# Altium schematic sheet Main.SchDoc
size 203 x 116 mm
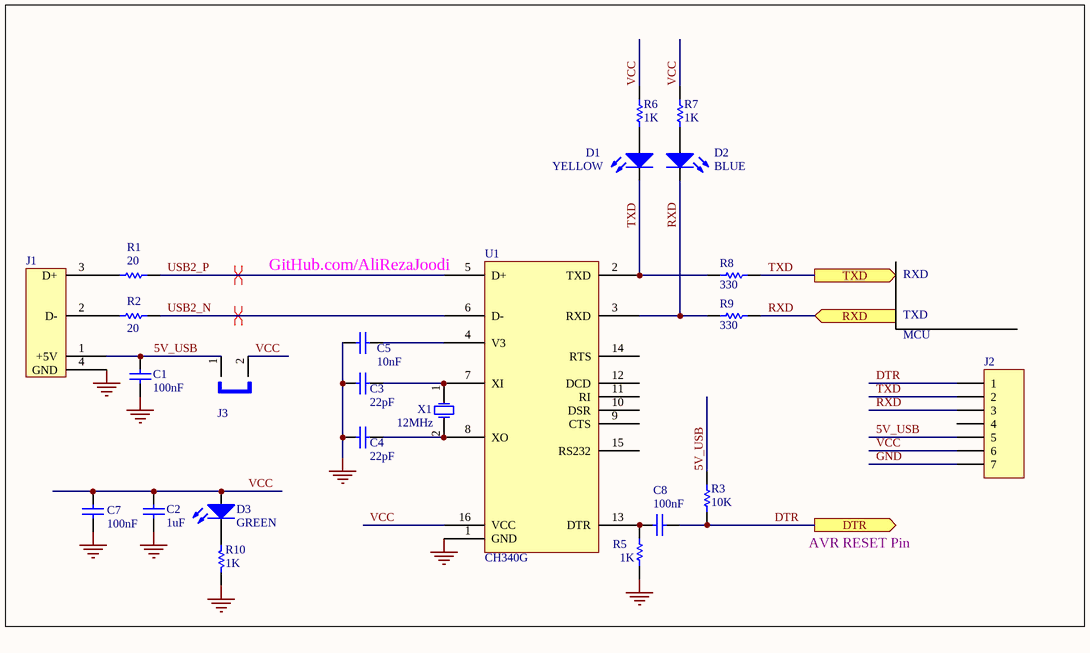
[diagram p0: Main.SchDoc]

## Parts
C1  100nF  [0805]
C2  1uF  [0805]
C3  22pF  [0805]
C4  22pF  [0805]
C5  10nF  [0805]
C7  100nF  [0805]
C8  100nF  [0805]
D1  YELLOW  [0805_Diode]
D2  BLUE  [0805_Diode]
D3  GREEN  [0805_Diode]
J1  USB Connector  [USB2.5-2H4D]  (value not drawn)
J2  7PIN  [HDR1X7]  (value not drawn)
J3  Jumper 2pin  [Jumper_Solder_2Pad_100X60]  (value not drawn)
R1  20  [0805]
R2  20  [0805]
R3  10K  [0805]
R5  1K  [0805]
R6  1K  [0805]
R7  1K  [0805]
R8  330  [0805]
R9  330  [0805]
R10  1K  [0805]
U1  CH340G  [SOIC127P602-16BM]
X1  12MHz  [HC49/4H_SMX]

## Ports
DTR (out), RXD (in), TXD (out)

## Nets
GND: C1.1 C2.1 C3.2 C4.2 C5.2 C7.1 J1.4(GND) J2.7 R5.1 R10.2 U1.1(GND)
5V_USB: C1.2 J1.1(+5V) J2.5 J3.1 R3.2
DTR: C8.1 J2.1 R3.1 ; port DTR
RXD: D2.2(K) J2.3 R9.1 R9.2 U1.3(RXD) ; port RXD
TXD: D1.2(K) J2.2 R8.1 R8.2 U1.2(TXD) ; port TXD
USB2_N: R2.1 U1.6(D-)
USB2_P: R1.1 U1.5(D+)
VCC: C2.2 C7.2 D3.1(A) J2.6 J3.2 R6.1 R7.1 U1.16(VCC)
NetC3_1: C3.1 U1.7(XI) X1.1(OSC1)
NetC4_1: C4.1 U1.8(XO) X1.2(OSC2)
NetC5_1: C5.1 U1.4(V3)
NetC8_2: C8.2 R5.2 U1.13(DTR)
NetD1_1: D1.1(A) R6.2
NetD2_1: D2.1(A) R7.2
NetD3_2: D3.2(K) R10.1
NetJ1_2: J1.2(D-) R2.2
NetJ1_3: J1.3(D+) R1.2

Not connected (* = marked no-connect by the designer): J2 4; U1 9(CTS) 10(DSR) 11(RI) 12(DCD) 14(RTS) 15(RS232)

## Layout directives
differential pair: USB2_N, USB2_P

## Notes on the sheet
- (near U1) GitHub.com/AliRezaJoodi
- RXD
- TXD
- MCU
- AVR RESET Pin

## Library data of the parts
C1-C5 C7 C8 = Cap: Capacitor; Manufacturer: Generic Components; Class I: Passive; Published: 8-Jun-2000; Revision: July-2002: Re-released for DXP Platform.; Publisher: Altium Limited; Class II: Capacitor
D1-D3 = Optical Transmitter: Typical INFRARED GaAs LED; Manufacturer: Generic Components; Class I: Optoelectronic; Published: 8-Jun-2000; Revision: July-2002: Re-released for DXP Platform.; Publisher: Altium Limited; Class II: LED
J1 = CONNECTOR_USB
J2 = Header 7: Header, 7-Pin; Manufacturer: Generic Components; Class I: Connector; Revision: July-2002: Re-released for DXP Platform.; Publisher: Altium Limited
J3 = Jumper 2pin: Jumper; Manufacturer: Generic Components; Published: 24-Mar-1999; Revision: July-2002: Re-released for DXP Platform.; Publisher: Altium Limited
R1-R3 R5-R10 = Res1: Resistor; Published: 8-Jun-2000; LatestRevisionDate: 17-Jul-2002; LatestRevisionNote: Re-released for DXP Platform.; PackageReference: AXIAL-0.3; Publisher: Altium Limited
U1 = CH340G: USB to UART Interface
X1 = XTAL: Crystal Oscillator; Manufacturer: Generic Components; Published: 8-Jun-2000; Revision: July-2002: Re-released for DXP Platform.; Publisher: Altium Limited; Class I: Oscillator; Class II: Crystal Oscillator